# Altium schematic sheet System.SchDoc: System Overview
size A4; Author: Andreas Rehn; CompanyName: Hochschule Ulm; DrawnBy: Andreas Rehn; Engineer: Andreas Rehn; Organization: Hochschule Ulm; Address1: Institut für Medizintechnik; Address2: und Mechatronik; Address3: Albert-Einstein-Allee 55; Address4: 89081 Ulm; SheetNumber: 1; SheetTotal: 11; DocumentName: SystemOverview; ImagePath: D:\workspace\Altium\USD\logo.jpg; ProjectName: Ultrasound Doppler 2015
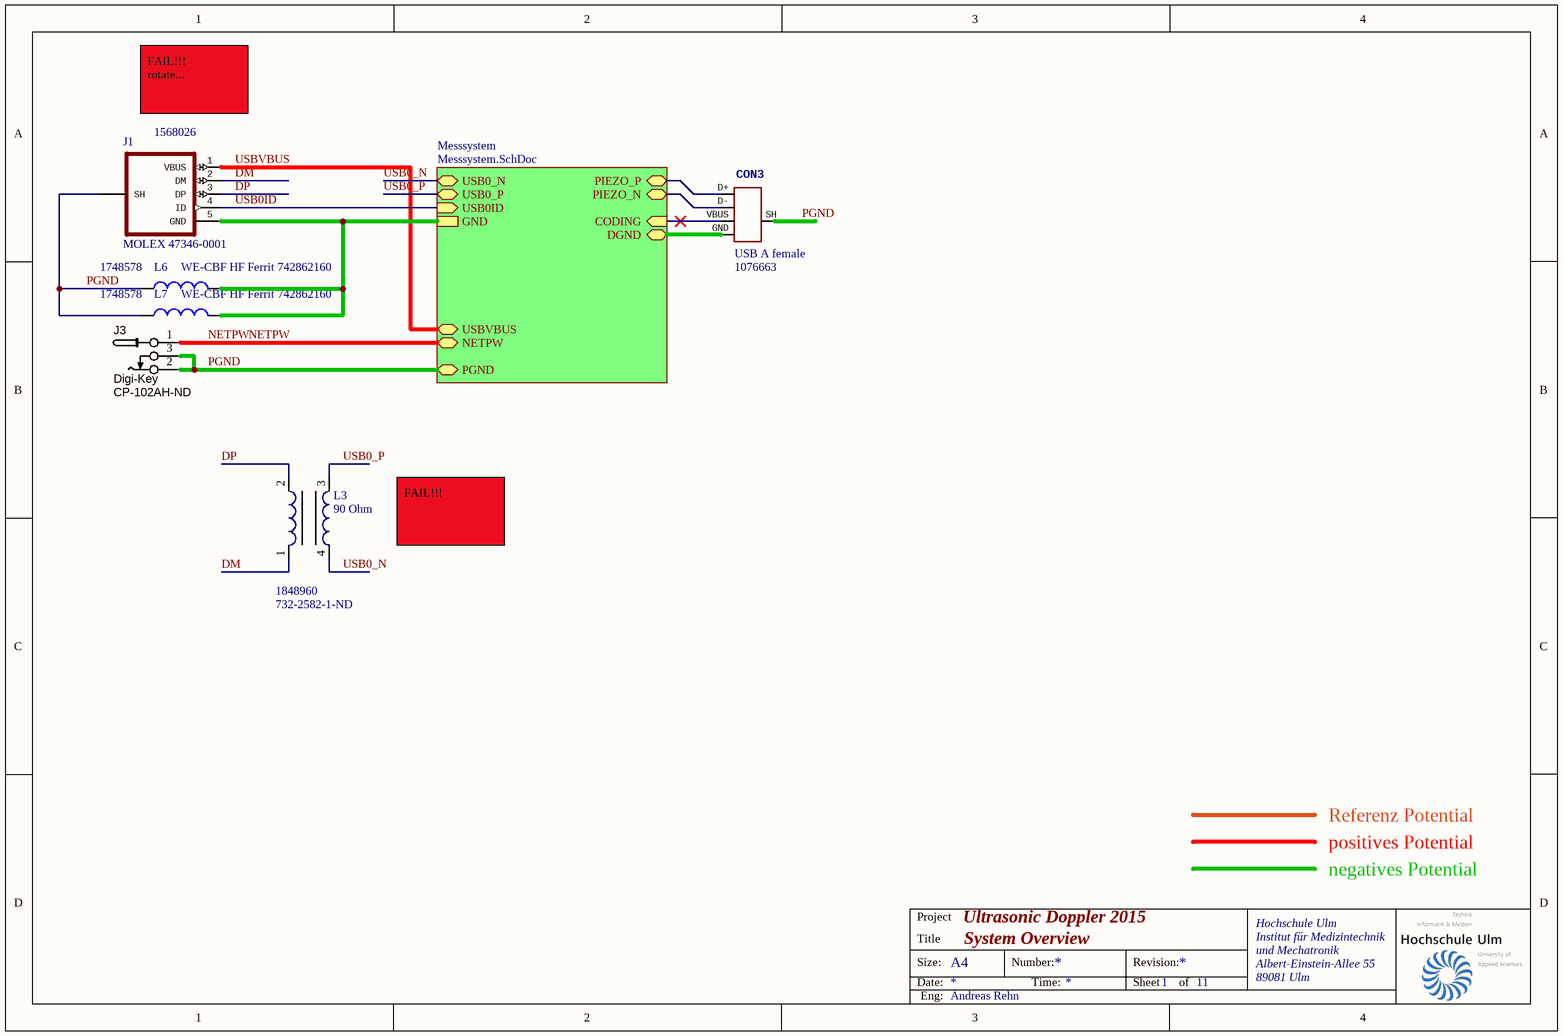
[diagram p0: System.SchDoc]

## Parts
CON3  USB A female  Supplier Part Number 1: 1076663  [USB A female]
J1  MOLEX 47346-0001  Supplier Part Number 1: 1568026  [USB Micro]
J3  Supplier 1: Digi-Key  Supplier Part Number 1: CP-102AH-ND  [CONN_PWR_JACK_2.1x5.5mm]  (hidden comment: CONN_PWR_JACK_2.1x5.5mm)
L3  90 Ohm  Supplier Part Number 1: 1848960  Supplier Part Number 2: 732-2582-1-ND  [WE-CNSW, 0603]
L6  WE-CBF HF Ferrit 742862160  Supplier Part Number 1: 1748578  [0603[1508]]
L7  WE-CBF HF Ferrit 742862160  Supplier Part Number 1: 1748578  [0603[1508]]

## Sub-sheets
Messsystem = Messsystem.SchDoc: USB0_P (bidir), USBVBUS (bidir), PGND, PIEZO_P, PIEZO_N, CODING (in), USB0_N (bidir), NETPW, USB0ID (in), DGND, GND

## Nets
DM: J1.2(DM) L3.1
DP: J1.3(DP) L3.2
NETPW: J3.1 ; sheet Messsystem/NETPW
PGND: CON3.SH J1.SH J3.2 J3.3 L6.1 L7.1 ; sheet Messsystem/PGND
USB0_N: L3.4 ; sheet Messsystem/USB0_N
USB0_P: L3.3 ; sheet Messsystem/USB0_P
USB0ID: J1.4(ID) ; sheet Messsystem/USB0ID
USBVBUS: J1.1(VBUS) ; sheet Messsystem/USBVBUS
NetCON3_D+: CON3.D+ ; sheet Messsystem/PIEZO_P
NetCON3_D-: CON3.D- ; sheet Messsystem/PIEZO_N
NetCON3_GND: CON3.GND ; sheet Messsystem/DGND
NetCON3_VBUS: CON3.VBUS ; sheet Messsystem/CODING
NetJ1_5: J1.5(GND) L6.2 L7.2 ; sheet Messsystem/GND

## Notes on the sheet
- FAIL!!!
  rotate...
- FAIL!!!
- Referenz Potential
- positives Potential
- negatives Potential
- Project
- Ultrasonic Doppler 2015
- Title
- Size:
- Date:
- A4
- Number:
- Time:
- Revision:
- Sheet
- of
- Eng:

## Library data of the parts
CON3 = USB-MB-S: Supplier 1: Farnell
J1 = USB: MICRO USB 2.0 BUCHSE, TYP B, SMD; value: MOLEX 47346-0001; Supplier 1: Farnell; ComponentLink1URL: http://www.farnell.com/datasheets/1681853.pdf; ComponentLink1Description: DataSheet
J3 = CONN_PWR_JACK_2.1x5.5mm: Power Connector, THT, 2.1mm ID, 5.5mm OD; Manufacturer 1: CUI Inc; Manufacturer Part Number 1: PJ-102AH; SCDType: undef; Category: Connectors; Mounting Type: Through Hole; Package / Case: PCB mount; Value: 2.1mm ID, 5.5mm OD
L3 = WE-CNSW 0603, 744230900: SMD Common Mode Noise Suppressor WE-CNSW,  Z= 90 Ohm; Manufacturer: Würth Elektronik eiSos GmbH; partNo: 744230900; Impedance: 90 Ohm; ComponentLink1Description: Manufacturer; ComponentLink1URL: http://www.we-online.de; Created by: Christin Zierenner; Created Date: March 2012; ComponentLink2Description: Datasheet; ComponentLink2URL: http://www.we-online.de/katalog/media/pdf/744230900.pdf; Supplier 1: Farnell; Supplier 2: Digi-Key
L6 L7 = Inductor: Ferrit; Code_IEC: 1005; Published: 8-Jun-2000; LatestRevisionDate: 29-May-2009; LatestRevisionNote: IPC-7351 Footprint Added.; PackageReference: 0402-A; Publisher: Altium Limited; PackageDescription: Chip Inductor; Code_JEITA: 0402; Value: WE-CBF HF Ferrit 742862160; Supplier 1: Farnell